# Altium schematic sheet sensors.SchDoc
size A4; DocumentNumber: 9; SheetNumber: 9; SheetTotal: 11
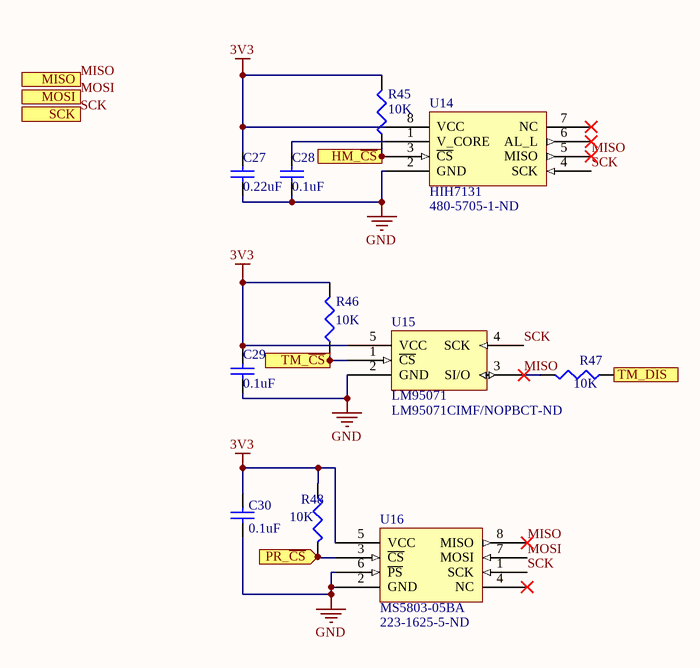
[diagram p0: sensors.SchDoc]

## Parts
C27  0.22uF  [1608[0603]]
C28  0.1uF  [1608[0603]]
C29  0.1uF  [1608[0603]]
C30  0.1uF  [1608[0603]]
R45  10K  [J1-0603]
R46  10K  [J1-0603]
R47  10K  [J1-0603]
R48  10K  [J1-0603]
U14  HIH7131  Supplier Part Number 1: 480-5705-1-ND  [SOIC127P500X600-8N]
U15  LM95071  Supplier Part Number 1: LM95071CIMF/NOPBCT-ND  [SOT-23-5_95P290X160-5N]
U16  MS5803-05BA  Supplier Part Number 1: 223-1625-5-ND  [MS5803-05BA_125P640x620-8N]

## Ports
HM_~{CS} (in), MISO (out), MOSI (in), PR_~{CS} (in), SCK (in), TM_DIS (in), TM_~{CS} (in)

## Nets
3V3: C27.2 C29.2 C30.2 R45.2 R46.2 R48.1 U14.8(VCC) U15.5(VCC) U16.5(VCC)
GND: C27.1 C28.1 C29.1 C30.1 U14.2(GND) U15.2(GND) U16.2(GND) U16.6(~{PS})
HM_~{CS}: R45.1 U14.3(~{CS}) ; port HM_~{CS}
MISO: R47.2 U14.5(MISO) U15.3(SI/O) U16.8(MISO) ; port MISO
MOSI: U16.7(MOSI) ; port MOSI
PR_~{CS}: R48.2 U16.3(~{CS}) ; port PR_~{CS}
SCK: U14.4(SCK) U15.4(SCK) U16.1(SCK) ; port SCK
TM_~{CS}: R46.1 U15.1(~{CS}) ; port TM_~{CS}
TM_DIS: R47.1 ; port TM_DIS
NetC28_2: C28.2 U14.1(V_CORE)

Not connected (* = marked no-connect by the designer): U14 6(AL_L)* 7(NC)*; U16 4(NC)*

## Library data of the parts
C27-C30 = Cap Semi: Capacitor (Semiconductor SIM Model); Published: 8-Jun-2000; LatestRevisionDate: 29-May-2009; LatestRevisionNote: IPC-7351 Footprint Added.; PackageReference: C1206; Publisher: Altium Limited; PackageDescription: Chip Capacitor; Supplier: Digi-Key
  C27: Value: 0.22uF; Supplier Part Number: 1276-1112-1-ND
  C28-C30: Value: 0.1uF; Supplier Part Number: 587-3807-1-ND
R45-R48 = Res3: Resistor; Published: 8-Jun-2000; LatestRevisionDate: 29-May-2009; LatestRevisionNote: IPC-7351 Footprint Added.; PackageReference: J1-0603; Publisher: Altium Limited; PackageDescription: Chip Resistor; Value: 10K; Supplier: Digi-Key
U14 = HIH7131: Digital humidity/temperature sensors. +/- 3% RH, 0-100%, SPI output. Model version with filter and condensation resistant.; Supplier 1: Digi-Key; Supplier: Digi-Key
U15 = LM95071: 13 bit plus sign digital temperature sensor. Nominal +/- 1 C accuracy from 0-70 C.; Supplier 1: Digi-Key; Supplier: Digi-Key
U16 = MS5803-05BA: Digital 24-bit pressure sensor with SPI output. Operating range from 0-5bar, includes onboard temperature sensor and hermetic seal.; Supplier 1: Digi-Key; Supplier: Digi-Key